# Altium schematic sheet temp_sensor.SchDoc
size A4
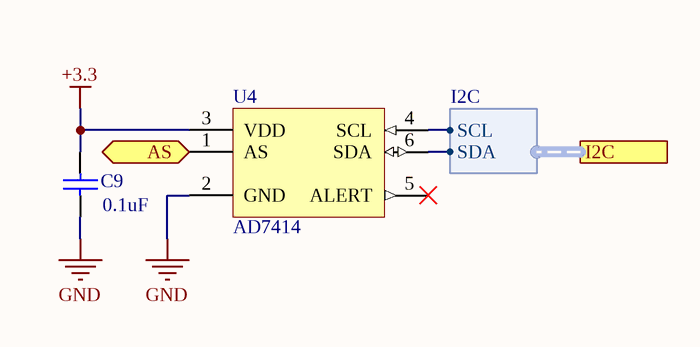
[diagram p0: temp_sensor.SchDoc]

## Parts
C9  value 0.1uF  [C0603]  (hidden comment: Cap)
U4  AD7414  [AD7414]

## Ports
AS (in), I2C (harness I2C)

## Harnesses
I2C: SCL, SDA

## Nets
+3.3: C9.2 U4.3(VDD)
GND: C9.1 U4.2(GND)
AS: U4.1(AS) ; port AS
NetU4_4: U4.4(SCL) ; port I2C.SCL
NetU4_6: U4.6(SDA) ; port I2C.SDA

Not connected (* = marked no-connect by the designer): U4 5(ALERT)*

## Library data of the parts
C9 = Cap: Capacitor; Published: 8-Jun-2000; LatestRevisionDate: 17-Jul-2002; LatestRevisionNote: Re-released for DXP Platform.; PackageReference: RAD-0.3; Publisher: Altium Limited; farnell: 1759122
U4 = AD7414: ANALOG DEVICES - AD7414ARTZ-0500RL7. - TEMP SENSOR, 10BIT, SMB/12C, SOT23-6; farnell: 1651313